# Altium schematic sheet Hecquyn_SCH_Proto1_210521.SchDoc
size A; PageSetup: Record=PageOptions|CenterHorizontal=True|CenterVertical=True|PrintScale=1.11|XCorrection=1.00|YCorrection=1.00|PrintKind=2|BorderSize=5000000|LeftOffset=0|BottomOffset=0|Orientation=2|PaperLength=1000|PaperWidth=1000|Scale=100|PaperSource=7|PrintQuality=-3|MediaType=1|DitherType=10|PrintScaleMode=1|PaperKind=Letter|PaperIndex=1
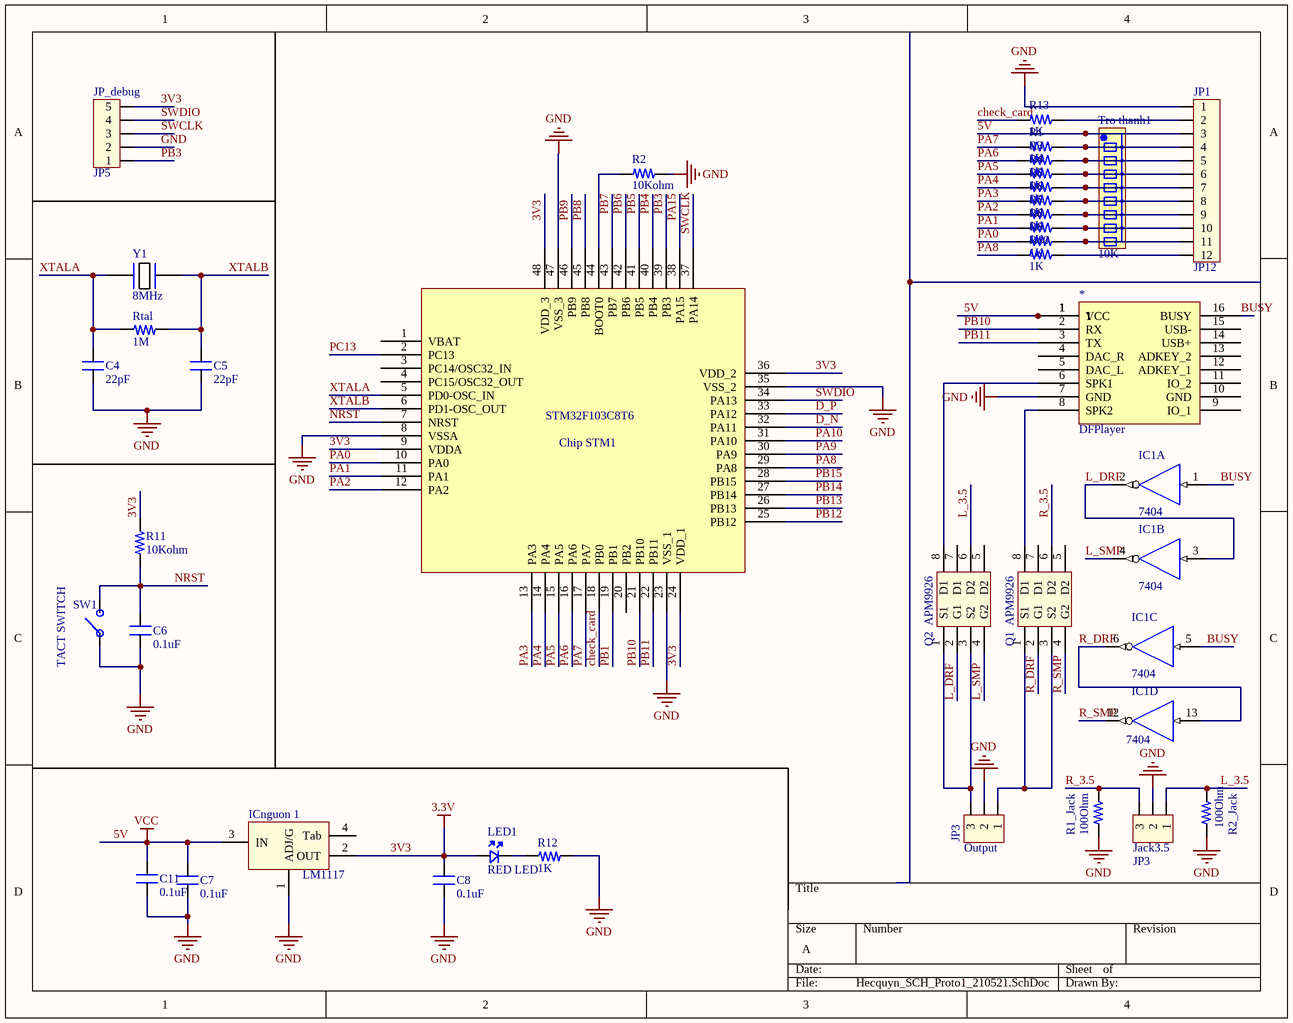
[diagram p0: Hecquyn_SCH_Proto1_210521.SchDoc]

## Parts
*  DFPlayer  [DFplayer]
C4  22pF  [CAP_0805]
C5  22pF  [CAP_0805]
C6  0.1uF  [CAP_0805]
C7  0.1uF  [CAP_0805]
C8  0.1uF  [CAP_0805]
C11  0.1uF  [CAP_0805]
Chip_STM1  STM32F103C8T6  [LQFP-48_19.6_393_58X11_SMD]
IC1  7404  [DIP14/W0.3]  (parts A,B,C,D of 6)
ICnguon_1  LM1117  [SOT223-4N]
Jack3.5  JP3  [CON3]
JP1  JP12  [CON12]
JP_debug  JP5  [CON5]
LED1  RED LED  [LED_0805]
Output  JP3  [CON3]
Q1  APM9926  [SO-8]
Q2  APM9926  [SO-8]
R1  1K  [RES_0805]
R1_Jack  100Ohm  [RES_0805]
R2  10Kohm  [RES_0805]
R2_Jack  100Ohm  [RES_0805]
R3  1K  [RES_0805]
R4  1K  [RES_0805]
R5  1K  [RES_0805]
R6  1K  [RES_0805]
R7  1K  [RES_0805]
R8  1K  [RES_0805]
R9  1K  [RES_0805]
R10  1K  [RES_0805]
R11  10Kohm  [RES_0805]
R12  1K  [RES_0805]
R13  1K  [RES_0805]
Rtal  1M  [RES_0805]
SW1  TACT SWITCH  [SW_342_SMD]
Tro_thanh1  10K  [RN8]
Y1  8MHz  [XTAL_314_240X47_SMD]

## Nets
3V3: C8.2 Chip_STM1.9(VDDA) Chip_STM1.24(VDD_1) Chip_STM1.36(VDD_2) Chip_STM1.48(VDD_3) ICnguon_1.2(OUT) JP_debug.5 LED1.A R11.2  [also labelled 3.3V]
5V: *.1 C7.2 C11.2 IC1.14(VCC) ICnguon_1.3(IN) JP1.3 Tro_thanh1.1  [also labelled VCC]
GND: *.7(GND) C4.1 C5.1 C6.1 C7.1 C8.1 C11.1 Chip_STM1.8(VSSA) Chip_STM1.23(VSS_1) Chip_STM1.35(VSS_2) Chip_STM1.47(VSS_3) IC1.7(GND) ICnguon_1.1(ADJ/G) Jack3.5.2 JP1.1 JP_debug.2 Output.2 R1_Jack.1 R2.2 R2_Jack.1 R12.1 SW1.1
BUSY: *.16(BUSY) IC1.1(A) IC1.5(A)
check_card: Chip_STM1.18(PB0) R13.1
D_N: Chip_STM1.32(PA11)
D_P: Chip_STM1.33(PA12)
L_3.5: Jack3.5.1 Q2.6(D2) R2_Jack.2
L_DRF: IC1.2(~{O}) IC1.3(A) Q2.2(G1)
L_SMP: IC1.4(~{O}) Q2.4(G2)
NRST: C6.2 Chip_STM1.7(NRST) R11.1 SW1.2
PA0: Chip_STM1.10(PA0) R9.1
PA1: Chip_STM1.11(PA1) R8.1
PA2: Chip_STM1.12(PA2) R7.1
PA3: Chip_STM1.13(PA3) R6.1
PA4: Chip_STM1.14(PA4) R5.1
PA5: Chip_STM1.15(PA5) R4.1
PA6: Chip_STM1.16(PA6) R3.1
PA7: Chip_STM1.17(PA7) R1.1
PA8: Chip_STM1.29(PA8) R10.1
PA9: Chip_STM1.30(PA9)
PA10: Chip_STM1.31(PA10)
PA15: Chip_STM1.38(PA15)
PB1: Chip_STM1.19(PB1)
PB3: Chip_STM1.39(PB3) JP_debug.1
PB4: Chip_STM1.40(PB4)
PB5: Chip_STM1.41(PB5)
PB6: Chip_STM1.42(PB6)
PB7: Chip_STM1.43(PB7)
PB8: Chip_STM1.45(PB8)
PB9: Chip_STM1.46(PB9)
PB10: *.2(RX) Chip_STM1.21(PB10)
PB11: *.3(TX) Chip_STM1.22(PB11)
PB12: Chip_STM1.25(PB12)
PB13: Chip_STM1.26(PB13)
PB14: Chip_STM1.27(PB14)
PB15: Chip_STM1.28(PB15)
PC13: Chip_STM1.2(PC13)
R_3.5: Jack3.5.3 Q1.6(D2) R1_Jack.2
R_DRF: IC1.6(~{O}) IC1.13(A) Q1.2(G1)
R_SMP: IC1.12(~{O}) Q1.4(G2)
SWCLK: Chip_STM1.37(PA14) JP_debug.3
SWDIO: Chip_STM1.34(PA13) JP_debug.4
XTALA: C4.2 Chip_STM1.5(PD0-OSC_IN) Rtal.2 Y1.1
XTALB: C5.2 Chip_STM1.6(PD1-OSC_OUT) Rtal.1 Y1.2
Net*_6: *.6(SPK1) Q2.8(D1)
Net*_8: *.8(SPK2) Q1.8(D1)
NetChip_STM1_44: Chip_STM1.44(BOOT0) R2.1
NetJP1_2: JP1.2 R13.2
NetJP1_4: JP1.4 R1.2 Tro_thanh1.2
NetJP1_5: JP1.5 R3.2 Tro_thanh1.3
NetJP1_6: JP1.6 R4.2 Tro_thanh1.4
NetJP1_7: JP1.7 R5.2 Tro_thanh1.5
NetJP1_8: JP1.8 R6.2 Tro_thanh1.6
NetJP1_9: JP1.9 R7.2 Tro_thanh1.7
NetJP1_10: JP1.10 R8.2 Tro_thanh1.8
NetJP1_11: JP1.11 R9.2 Tro_thanh1.9
NetJP1_12: JP1.12 R10.2
NetLED1_K: LED1.K R12.2
NetOutput_1: Output.1 Q1.1(S1) Q1.3(S2)
NetOutput_3: Output.3 Q2.1(S1) Q2.3(S2)

Not connected (* = marked no-connect by the designer): * 4(DAC_R) 5(DAC_L) 9(IO_1) 10(GND) 11(IO_2) 12(ADKEY_1) 13(ADKEY_2) 14(USB+) 15(USB-); Chip_STM1 1(VBAT) 3(PC14/OSC32_IN) 4(PC15/OSC32_OUT) 20(PB2); ICnguon_1 4(Tab); Q1 5(D2) 7(D1); Q2 5(D2) 7(D1)

## Library data of the parts
* = Component_1
C4 C5 = CAP_22pF-50V-5%-0805: 22pF ±5% 50V Ceramic Capacitor C0G, NP0 0805 (2012 Metric); Manufacturer: KEMET; Manufacturer Part Number: C0805C220J5GACTU; Case/Package: 0805; Supplier-1: Digikey; Supplier Part Number-1: 399-1113-1-ND
C6-C8 C11 = CAP_0.1uF-50V-5%-0805: 0.1µF ±5% 50V Ceramic Capacitor X7R 0805 (2012 Metric); Manufacturer: KEMET; Manufacturing Part Number: C0805C104J5RACTU; Case/Package: 0805 (2012 Metric); Supplier-1: Digikey; Supplier Part Number-1: 399-1171-1-ND
Chip_STM1 = IC-STM32F103C8T6 _1: ARM® Cortex®-M3 STM32F1 Microcontroller IC 32-Bit 72MHz 64KB (64K x 8) FLASH; Manufacturer: STMicroelectronics; Manufacturer Part Number: STM32F103C8T6; Case/Package: 48-LQFP; Supplier-1: Digikey; Supplier Part Number-1: 497-6063-ND
IC1 = 7404: Hex Inverter; Code_IPC: SOIC127P600-14; ComponentLink1Description: Manufacturer Link; ComponentLink1URL: http://www.national.com/; ComponentLink2Description: Datasheet; ComponentLink2URL: http://www.fairchildsemi.com/ds/74/74F04.pdf; Value: 7404
ICnguon_1 = LM1117: 3v3; Value: LM317
Jack3.5 Output = Con3: Connector 3; Value: Connector 3
JP1 = Con12: Connector 12; Value: Connector 12
JP_debug = Con5: Connector 5; Value: Connector 5
LED1 = LED-RED_10mA-0805: Red 621nm LED Indication - Discrete 2V 0805 (2012 Metric); Manufacturer: Lite-On Inc.; Manufacturer Part Number: LTST-C170EKT; Case/ Package: 0805; Supplier-1: Digikey; Supplier Part Number-1: 160-1178-1-ND
Q1 Q2 = APM4953: Dual P-Channel Enhancement Mode MOSFET
R1 R1_Jack R2_Jack R3-R10 R12 R13 = RES_1K-0.125W-1%-0805: 1 kOhms ±1% 0.125W, 1/8W Chip Resistor 0805 (2012 Metric) Moisture Resistant Thick Film; Manufacturer: 垈㎵á; Manufacturer Part Number: RC0805FR-071KL; Case/Package: 0805; Supplier-1: Digikey; Supplier Part Number-1: 311-1.00KCRCT-ND
R2 = RES_10K-0.125W-1%-0805: 10 kOhms ±1% 0.125W, 1/8W Chip Resistor 0805 (2012 Metric) Moisture Resistant Thick Film; Manufacturer: Yageo; Manufacturing Part Number: RC0805FR-0710KL; Case/Package: 0805; Supplier-1: Digikey; Supplier Part Number-1: 311-10.0KCRCT-ND
R11 Rtal = RES_10MOHM-0.125W-1%-0805: 10 MOhms ±1% 0.125W, 1/8W Chip Resistor 0805 (2012 Metric) Automotive AEC-Q200, High Voltage Thick Film; Manufacturer: Rohm Semiconductor; Manufacturing Part Number: KTR10EZPF1005; Case/Package: 0805 (2012 Metric); Supplier-1: Digikey; Supplier Part Number-1: RHM10.0MAHCT-ND
SW1 = SW_KSR223GLFG-SMD: Tactile Switch SPST-NO Top Actuated Surface Mount; Manufacturer: C&K; Manufacturing Part Number: KSR223GLFG; Case/Package: SMD; Supplier-1: Digikey; Supplier Part Number-1: 401-1704-1-ND
Tro_thanh1 = RN8: Resistor 8 (Thanh); Value: Tro thanh 10K
Y1 = XTAL_8MHZ-LFXTAL030234: Crystals 8MHz 22pF -20C 70C; Manufacturer: IQD Frequency Products; Manufacturing Part Number: LFXTAL030234Reel; Case/Package: SMD; Supplier-1: Mouser; Supplier Part Number-1: 449-LFXTAL030234REEL